# Altium schematic sheet Koruma.SchDoc (part 2 of 3)
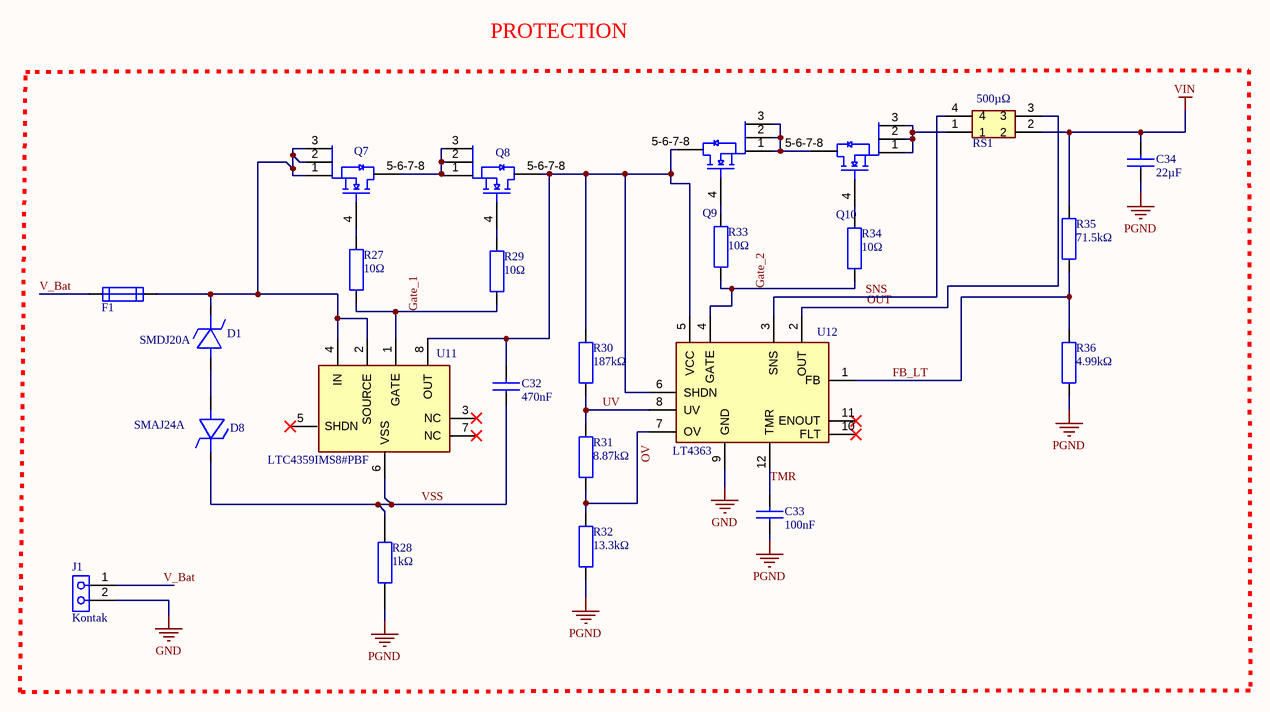
[diagram p1: Koruma.SchDoc]
## Library data of the parts
C32 = W3F15C4738AT1F: 0612/0805/1206 Feedthru Ceramic Capacitors 1206 50V 47000pF; Manufacturer: TAIYO YUDEN; Manufacturer Part Number: MCASU168SB7474KTCA01; Current Rating: 300mA; DC Resistance (DCR): 600mΩ; Insulation Resistance: 1GΩ; Number of Circuits: 1; Tolerance: 50%; Supplier: Arrow Electronics; Supplier Part Number: MCASU168SB7474KTCA01; RoHS: Compliant; Category: Ceramic Capacitors; Stock: 471; Pricing: 1=0,0439 (USD); Case/Package: 0603; Dielectric Material: Ceramic; Height: 800µm; Length: 1.6mm; Lifecycle Status: Production; Max Operating Temperature: 125°C; Min Operating Temperature: -55°C; Mounting Technology: Surface Mount; Number of Terminals: 2; Ratings: AEC-Q200; REACH SVHC: Yes; Voltage Rating (DC): 50V; Width: 800µm; ComponentLink1URL: https://datasheet.octopart.com:443/MCASU168SB7474KTCA01-Taiyo-Yuden-datasheet-182118782.pdf?src-supplier=IHS; ComponentLink1Description: https://datasheet.octopart.com:443/MCASU168SB7474KTCA01-Taiyo-Yuden-datasheet-182118782.pdf?src-supplier=IHS; ComponentLink2URL: https://datasheet.octopart.com:443/MCASU168SB7474KTCA01-Taiyo-Yuden-datasheet-176292839.pdf?src-supplier=Future+Electronics; ComponentLink2Description: https://datasheet.octopart.com:443/MCASU168SB7474KTCA01-Taiyo-Yuden-datasheet-176292839.pdf?src-supplier=Future+Electronics; ComponentLink3URL: https://datasheet.octopart.com:443/MCASU168SB7474KTCA01-Taiyo-Yuden-datasheet-182282442.pdf?src-supplier=Future+Electronics; ComponentLink3Description: https://datasheet.octopart.com:443/MCASU168SB7474KTCA01-Taiyo-Yuden-datasheet-182282442.pdf?src-supplier=Future+Electronics; China RoHS: Compliant; Export Control Classification Number (ECCN) Code: EAR99; Harmonized Tariff Schedule (HTS) Code: 8504.50.80.00; Introduction Date: 2002-04-23; Packaging: Tape and Reel; Termination: SMD/SMT; Voltage Rating: 50V; ComponentLink4URL: https://datasheet.octopart.com:443/W3F15C4738AT1F-KYOCERA-AVX-datasheet-159616755.pdf?src-supplier=IHS; ComponentLink4Description: https://datasheet.octopart.com:443/W3F15C4738AT1F-KYOCERA-AVX-datasheet-159616755.pdf?src-supplier=IHS; ComponentLink5URL: https://datasheet.octopart.com:443/W3F15C4738AT1F-AVX-datasheet-159777.pdf?src-supplier=Mouser; ComponentLink5Description: https://datasheet.octopart.com:443/W3F15C4738AT1F-AVX-datasheet-159777.pdf?src-supplier=Mouser; ComponentLink6URL: http://sigma.octopart.com:80/conflict_mineral_statement/AVX-company-34.pdf?src-supplier=Compliance+Statements; ComponentLink6Description: http://sigma.octopart.com:80/conflict_mineral_statement/AVX-company-34.pdf?src-supplier=Compliance+Statements; ComponentLink7URL: http://sigma.octopart.com:80/reach_statement/AVX-company-19.pdf?src-supplier=Compliance+Statements; ComponentLink7Description: http://sigma.octopart.com:80/reach_statement/AVX-company-19.pdf?src-supplier=Compliance+Statements
C33 = GRM155R71C104KA88D: 16V 100nF X7R ±10% 0402 Multilayer Ceramic Capacitors MLCC - SMD/SMT ROHS; Manufacturer: Murata; Manufacturer Lifecycle Status: NRND; Insulation Resistance: 10GΩ; Supplier: Future Electronics; Supplier Part Number: GRM155R71C104KA88D; Manufacturer Part Number: GRM155R71C104KA88D; RoHS: Compliant; Category: Ceramic Capacitors; Stock: 9240000; Pricing: 20000=0,001, 50000=0,001, 200000=0,0009, 500000=0,0009, 1250000=0,0009 (USD); Case/Package: 0402; Case Code (Imperial): 0402; Case Code (Metric): 1005; Country of Origin: Japan, Mainland China, Philippines, Singapore, Thailand; Depth: 500µm; Dielectric: X7R; Dielectric Material: Ceramic; Export Control Classification Number (ECCN) Code: EAR99; Height: 500µm; Harmonized Tariff Schedule (HTS) Code: 8532.24.00.20; Introduction Date: 2004-11-19; Lead Free: Lead Free; Length: 1mm; Lifecycle Status: NRND; Material: Ceramic; Max Operating Temperature: 125°C; Min Operating Temperature: -55°C; Mounting Technology: Surface Mount; Pins: 2; Number of Terminals: 2; Packaging: Cut Tape; Radiation Hardening: No; REACH SVHC: Yes; Schedule B: 8532240020, 8532240020|8532240020|8532240020|8532240020|8532240020|8532240020|8532240020|8532240020|8532240020|8532240020|8532240020|8532240020|8532240020, 8532240020|8532240020|8532240020|8532240020|8532240020|8532240020|8532240020|8532240020|8532240020|8532240020|8532240020|8532240020|8532240020|8532240020, 8532240020|8532240020|8532240020|8532240020|8532240020|8532240020|8532240020|8532240020|8532240020|8532240020|8532240020|8532240020|8532240020|8532240020|8532240020; Termination: SMD/SMT; Thickness: 500µm; Tolerance: 10%; Voltage: 16V; Voltage Rating: 16V; Voltage Rating (DC): 16V; Width: 500µm; ComponentLink1URL: https://datasheet.octopart.com:443/GRM155R71C104KA88D-Murata-datasheet-6387203.pdf?src-supplier=Upverter; ComponentLink1Description: https://datasheet.octopart.com:443/GRM155R71C104KA88D-Murata-datasheet-6387203.pdf?src-supplier=Upverter; ComponentLink2URL: https://datasheet.octopart.com:443/GRM155R71C104KA88D-Murata-datasheet-501912.pdf?src-supplier=Farnell; ComponentLink2Description: https://datasheet.octopart.com:443/GRM155R71C104KA88D-Murata-datasheet-501912.pdf?src-supplier=Farnell; ComponentLink3URL: https://datasheet.octopart.com:443/GRM155R71C104KA88D-Murata-datasheet-62320226.pdf?src-supplier=Farnell; ComponentLink3Description: https://datasheet.octopart.com:443/GRM155R71C104KA88D-Murata-datasheet-62320226.pdf?src-supplier=Farnell; ComponentLink4URL: https://datasheet.octopart.com:443/GRM155R71C104KA88D-Murata-datasheet-514334.pdf?src-supplier=Farnell; ComponentLink4Description: https://datasheet.octopart.com:443/GRM155R71C104KA88D-Murata-datasheet-514334.pdf?src-supplier=Farnell; ComponentLink5URL: https://datasheet.octopart.com:443/GRM155R71C104KA88D-Murata-datasheet-165579666.pdf?src-supplier=TME; ComponentLink5Description: https://datasheet.octopart.com:443/GRM155R71C104KA88D-Murata-datasheet-165579666.pdf?src-supplier=TME; ComponentLink6URL: https://datasheet.octopart.com:443/GRM155R71C104KA88D-Murata-datasheet-81455578.pdf?src-supplier=TME; ComponentLink6Description: https://datasheet.octopart.com:443/GRM155R71C104KA88D-Murata-datasheet-81455578.pdf?src-supplier=TME; ComponentLink7URL: https://datasheet.octopart.com:443/GRM155R71C104KA88D-Murata-datasheet-59876780.pdf?src-supplier=TME; ComponentLink7Description: https://datasheet.octopart.com:443/GRM155R71C104KA88D-Murata-datasheet-59876780.pdf?src-supplier=TME; ComponentLink8URL: https://datasheet.octopart.com:443/GRM155R71C104KA88D-Murata-datasheet-141266224.pdf?src-supplier=Ciiva; ComponentLink8Description: https://datasheet.octopart.com:443/GRM155R71C104KA88D-Murata-datasheet-141266224.pdf?src-supplier=Ciiva; ComponentLink9URL: https://datasheet.octopart.com:443/GRM155R71C104KA88D-Murata-datasheet-140690972.pdf?src-supplier=Ciiva; ComponentLink9Description: https://datasheet.octopart.com:443/GRM155R71C104KA88D-Murata-datasheet-140690972.pdf?src-supplier=Ciiva; ComponentLink10URL: https://datasheet.octopart.com:443/GRM155R71C104KA88D-Murata-datasheet-138740890.pdf?src-supplier=Ciiva; ComponentLink10Description: https://datasheet.octopart.com:443/GRM155R71C104KA88D-Murata-datasheet-138740890.pdf?src-supplier=Ciiva; ComponentLink11URL: https://datasheet.octopart.com:443/GRM155R71C104KA88D-Murata-datasheet-120101189.pdf?src-supplier=Megastar; ComponentLink11Description: https://datasheet.octopart.com:443/GRM155R71C104KA88D-Murata-datasheet-120101189.pdf?src-supplier=Megastar; ComponentLink12URL: https://datasheet.octopart.com:443/GRM155R71C104KA88D-Murata-datasheet-96971104.pdf?src-supplier=Future+Electronics; ComponentLink12Description: https://datasheet.octopart.com:443/GRM155R71C104KA88D-Murata-datasheet-96971104.pdf?src-supplier=Future+Electronics; ComponentLink13URL: https://datasheet.octopart.com:443/GRM155R71C104KA88D-Murata-datasheet-22122223.pdf?src-supplier=Future+Electronics; ComponentLink13Description: https://datasheet.octopart.com:443/GRM155R71C104KA88D-Murata-datasheet-22122223.pdf?src-supplier=Future+Electronics; ComponentLink14URL: https://datasheet.octopart.com:443/GRM155R71C104KA88D-Murata-datasheet-14400564.pdf?src-supplier=Future+Electronics; ComponentLink14Description: https://datasheet.octopart.com:443/GRM155R71C104KA88D-Murata-datasheet-14400564.pdf?src-supplier=Future+Electronics; ComponentLink15URL: https://datasheet.octopart.com:443/GRM155R71C104KA88D-Murata-datasheet-44106293.pdf?src-supplier=Future+Electronics; ComponentLink15Description: https://datasheet.octopart.com:443/GRM155R71C104KA88D-Murata-datasheet-44106293.pdf?src-supplier=Future+Electronics; ComponentLink16URL: https://datasheet.octopart.com/GRM155R71C104KA88D-Murata-datasheet-12515295.pdf; ComponentLink16Description: https://datasheet.octopart.com/GRM155R71C104KA88D-Murata-datasheet-12515295.pdf; ComponentLink17URL: https://datasheet.octopart.com/GRM155R71C104KA88D-Murata-datasheet-12510076.pdf; ComponentLink17Description: https://datasheet.octopart.com/GRM155R71C104KA88D-Murata-datasheet-12510076.pdf; ComponentLink18URL: https://datasheet.octopart.com/GRM155R71C104KA88D-Murata-datasheet-11978611.pdf; ComponentLink18Description: https://datasheet.octopart.com/GRM155R71C104KA88D-Murata-datasheet-11978611.pdf; ComponentLink19URL: https://datasheet.octopart.com/GRM155R71C104KA88D-Murata-datasheet-10025737.pdf; ComponentLink19Description: https://datasheet.octopart.com/GRM155R71C104KA88D-Murata-datasheet-10025737.pdf; ComponentLink20URL: https://datasheet.octopart.com/GRM155R71C104KA88D-Murata-datasheet-8819587.pdf; ComponentLink20Description: https://datasheet.octopart.com/GRM155R71C104KA88D-Murata-datasheet-8819587.pdf; ComponentLink21URL: https://datasheet.octopart.com/GRM155R71C104KA88D-Murata-datasheet-12555248.pdf; ComponentLink21Description: https://datasheet.octopart.com/GRM155R71C104KA88D-Murata-datasheet-12555248.pdf; ComponentLink22URL: https://datasheet.octopart.com:443/GRM155R71C104KA88D-Murata-datasheet-11864723.pdf?src-supplier=Arrow+Electronics; ComponentLink22Description: https://datasheet.octopart.com:443/GRM155R71C104KA88D-Murata-datasheet-11864723.pdf?src-supplier=Arrow+Electronics; ComponentLink23URL: https://datasheet.octopart.com:443/GRM155R71C104KA88D-Murata-datasheet-148211.pdf?src-supplier=Garrett; ComponentLink23Description: https://datasheet.octopart.com:443/GRM155R71C104KA88D-Murata-datasheet-148211.pdf?src-supplier=Garrett; ComponentLink24URL: https://datasheet.octopart.com:443/GRM155R71C104KA88D-Murata-datasheet-118811.pdf?src-supplier=DigiKey; ComponentLink24Description: https://datasheet.octopart.com:443/GRM155R71C104KA88D-Murata-datasheet-118811.pdf?src-supplier=DigiKey; ComponentLink25URL: https://datasheet.octopart.com:443/GRM155R71C104KA88D-Murata-datasheet-38265814.pdf?src-supplier=Newark; ComponentLink25Description: https://datasheet.octopart.com:443/GRM155R71C104KA88D-Murata-datasheet-38265814.pdf?src-supplier=Newark; ComponentLink26URL: http://sigma.octopart.com:80/reach_statement/Murata-company-16.pdf?src-supplier=Compliance+Statements; ComponentLink26Description: http://sigma.octopart.com:80/reach_statement/Murata-company-16.pdf?src-supplier=Compliance+Statements
C34 = C5750X7R1H226M250KB: 50V 22uF X7R 卤20% 2220 Multilayer Ceramic Capacitors MLCC - SMD/SMT ROHS; Manufacturer: TDK; Manufacturer Lifecycle Status: PRODUCTION; Tolerance: 20%; Supplier: Farnell; Supplier Part Number: C5750X7R1H226M250KB; Manufacturer Part Number: C5750X7R1H226M250KB; RoHS: Compliant; Category: Ceramic Capacitors; Stock: 4; Pricing: 1=3,8, 10=2,29, 50=2,23, 100=2,16, 200=2,06, 500=1,96 (EUR); Case/Package: 2220; Case Code (Metric): 5750; China RoHS: Compliant; Dielectric: X7R; Dielectric Material: Ceramic; Export Control Classification Number (ECCN) Code: EAR99; Height: 2.5mm; Harmonized Tariff Schedule (HTS) Code: 8532.24.00.20; Introduction Date: 2019-03-19; Lead Free: Lead Free; Length: 5.7mm; Lifecycle Status: Production; Material: Ceramic; Max Length: 6.1mm; Max Operating Temperature: 125°C; Max Width: 5.4mm; Min Length: 5.3mm; Min Operating Temperature: -55°C; Min Width: 4.6mm; Mounting Technology: Surface Mount; Number of Terminals: 2; REACH SVHC: Yes; Thickness: 2.5mm; Voltage Rating: 50V; Voltage Rating (DC): 50V; Width: 5mm; ComponentLink1URL: https://datasheet.octopart.com:443/C5750X7R1H226M250KB-TDK-datasheet-175423548.pdf?src-supplier=TME; ComponentLink1Description: https://datasheet.octopart.com:443/C5750X7R1H226M250KB-TDK-datasheet-175423548.pdf?src-supplier=TME; ComponentLink2URL: https://datasheet.octopart.com:443/C5750X7R1H226M250KB-TDK-datasheet-68298673.pdf?src-supplier=Upverter; ComponentLink2Description: https://datasheet.octopart.com:443/C5750X7R1H226M250KB-TDK-datasheet-68298673.pdf?src-supplier=Upverter; ComponentLink3URL: https://datasheet.octopart.com:443/C5750X7R1H226M250KB-TDK-datasheet-151546523.pdf?src-supplier=ODG+(Origin+Data+Global); ComponentLink3Description: https://datasheet.octopart.com:443/C5750X7R1H226M250KB-TDK-datasheet-151546523.pdf?src-supplier=ODG+(Origin+Data+Global); ComponentLink4URL: https://datasheet.octopart.com:443/C5750X7R1H226M250KB-TDK-datasheet-154546117.pdf?src-supplier=Farnell; ComponentLink4Description: https://datasheet.octopart.com:443/C5750X7R1H226M250KB-TDK-datasheet-154546117.pdf?src-supplier=Farnell; ComponentLink5URL: https://datasheet.octopart.com/C5750X7R1H226M250KB-TDK-datasheet-41194876.pdf; ComponentLink5Description: https://datasheet.octopart.com/C5750X7R1H226M250KB-TDK-datasheet-41194876.pdf; ComponentLink6URL: https://datasheet.octopart.com/C-Series-Ceramic-Chip-Capacitors-TDK-datasheet-family-84.pdf; ComponentLink6Description: https://datasheet.octopart.com/C-Series-Ceramic-Chip-Capacitors-TDK-datasheet-family-84.pdf; ComponentLink7URL: http://sigma.octopart.com:80/rohs_certificate/C-Series-Ceramic-Chip-Capacitors-TDK-family-108.pdf?src-supplier=Compliance+Statements; ComponentLink7Description: http://sigma.octopart.com:80/rohs_certificate/C-Series-Ceramic-Chip-Capacitors-TDK-family-108.pdf?src-supplier=Compliance+Statements
D1 = SMDJ20A: SMDJ Series 20 V 3000 W Surface Mount Uni-Directional TVS Diode - DO-214AB; Manufacturer: Littelfuse; Breakdown Voltage: 23.35V; Clamping Voltage: 32.4V; Direction: Unidirectional; Leakage Current: 2µA; Max Breakdown Voltage: 24.5V; Max Power Dissipation: 6.5W; Max Surge Current: 92.6A; Min Breakdown Voltage: 22.2V; Number of Channels: 1; Operating Supply Voltage: 20V; Peak Pulse Power: 3kW; Power Line Protection: No; Test Current: 1mA; Supplier: Farnell; Supplier Part Number: SMDJ20A; Manufacturer Part Number: SMDJ20A; RoHS: Compliant; Category: TVS Diodes; Stock: 2450; Pricing: 1=0,585, 10=0,485, 100=0,368, 500=0,347, 1000=0,34 (EUR); China RoHS: Non-Compliant; Composition: Zener; Lead Free: Lead Free; Lifecycle Status: Production; Max Operating Temperature: 150°C; Max Reverse Leakage Current: 2µA; Min Operating Temperature: -65°C; Mounting Technology: Surface Mount; Number of Elements: 1; Pins: 2; Number of Terminals: 2; Number of Unidirectional Channels: 1; Packaging: Cut Tape; Peak Pulse Current: 92.6A; Polarity: Unidirectional; Power Dissipation: 3kW; REACH SVHC: No; Reverse Breakdown Voltage: 22.2V; Reverse Standoff Voltage: 20V; Reverse Voltage: 20V; Schedule B: 8541100080, 8541100080|8541100080|8541100080|8541100080|8541100080; Termination: SMD/SMT; ComponentLink1URL: https://datasheet.octopart.com:443/SMDJ20A-Littelfuse-datasheet-150463583.pdf?src-supplier=Farnell; ComponentLink1Description: https://datasheet.octopart.com:443/SMDJ20A-Littelfuse-datasheet-150463583.pdf?src-supplier=Farnell; ComponentLink2URL: https://datasheet.octopart.com:443/SMDJ20A-Littelfuse-datasheet-63711006.pdf?src-supplier=element14+APAC; ComponentLink2Description: https://datasheet.octopart.com:443/SMDJ20A-Littelfuse-datasheet-63711006.pdf?src-supplier=element14+APAC; ComponentLink3URL: https://datasheet.octopart.com:443/SMDJ20A-Littelfuse-datasheet-23805045.pdf?src-supplier=Future+Electronics; ComponentLink3Description: https://datasheet.octopart.com:443/SMDJ20A-Littelfuse-datasheet-23805045.pdf?src-supplier=Future+Electronics; ComponentLink4URL: https://datasheet.octopart.com:443/SMDJ20A-Littelfuse-datasheet-14434287.pdf?src-supplier=Future+Electronics; ComponentLink4Description: https://datasheet.octopart.com:443/SMDJ20A-Littelfuse-datasheet-14434287.pdf?src-supplier=Future+Electronics; ComponentLink5URL: https://datasheet.octopart.com:443/SMDJ20A-Littelfuse-datasheet-130255154.pdf?src-supplier=Littelfuse+SCT; ComponentLink5Description: https://datasheet.octopart.com:443/SMDJ20A-Littelfuse-datasheet-130255154.pdf?src-supplier=Littelfuse+SCT; ComponentLink6URL: https://datasheet.octopart.com:443/SMDJ20A-Littelfuse-datasheet-10978972.pdf?src-supplier=TME; ComponentLink6Description: https://datasheet.octopart.com:443/SMDJ20A-Littelfuse-datasheet-10978972.pdf?src-supplier=TME; ComponentLink7URL: https://datasheet.octopart.com:443/SMDJ20A-Littelfuse-datasheet-32025630.pdf?src-supplier=Fuses+Unlimited; ComponentLink7Description: https://datasheet.octopart.com:443/SMDJ20A-Littelfuse-datasheet-32025630.pdf?src-supplier=Fuses+Unlimited
D8 = SMAJ24A: SMAJ Series 400 W 24 V Uni-Directional Surface Mount TVS Diode - DO-214AC; Manufacturer: Littelfuse; Breakdown Voltage: 28.1V; Value: 650pF; Clamping Voltage: 38.9V; Direction: Unidirectional; Element Configuration: Single; Forward Voltage: 3.5V; Leakage Current: 1µA; Max Breakdown Voltage: 29.5V; Max Junction Temperature (Tj): 150°C; Max Output current: 10.3A; Max Power Dissipation: 3.3W; Min Breakdown Voltage: 26.7V; Number of Channels: 1; Operating Supply Voltage: 24V; Peak Pulse Power: 400W; Power Line Protection: No; Test Current: 1mA; Supplier: Farnell; Supplier Part Number: SMAJ24A; Manufacturer Part Number: SMAJ24A; RoHS: Compliant; Category: TVS Diodes; Stock: 10000; Pricing: 5000=0,121, 15000=0,106 (EUR); Case/Package: SMA; China RoHS: Non-Compliant; Composition: Zener; Export Control Classification Number (ECCN) Code: EAR99; Height: 2.29mm; Harmonized Tariff Schedule (HTS) Code: 8541.10.00.50; Introduction Date: 2003-11-20; Lead Free: Lead Free; Length: 4.5mm; Lifecycle Status: Production; Max Operating Temperature: 150°C; Max Reverse Leakage Current: 1µA; Max Surge Current: 10.3A; Min Operating Temperature: -65°C; Mounting Technology: Surface Mount; Number of Elements: 1; Pins: 2; Number of Terminals: 2; Number of Unidirectional Channels: 1; Packaging: Tape & Reel; Peak Pulse Current: 10.3A; Peak Reverse Current: 1µA; Polarity: Unidirectional; Power Dissipation: 400W; Power Rating: 400W; Radiation Hardening: No; REACH SVHC: No; Reverse Breakdown Voltage: 26.7V; Reverse Standoff Voltage: 24V; Reverse Voltage: 24V; Schedule B: 8541100080, 8541100080|8541100080|8541100080|8541100080|8541100080; Termination: SMD/SMT; Voltage Rating (DC): 24V; Width: 2.79mm; ComponentLink1URL: https://datasheet.octopart.com:443/SMAJ24A-Littelfuse-datasheet-150463581.pdf?src-supplier=Farnell; ComponentLink1Description: https://datasheet.octopart.com:443/SMAJ24A-Littelfuse-datasheet-150463581.pdf?src-supplier=Farnell; ComponentLink2URL: https://datasheet.octopart.com:443/SMAJ24A-Littelfuse-datasheet-63710798.pdf?src-supplier=element14+APAC; ComponentLink2Description: https://datasheet.octopart.com:443/SMAJ24A-Littelfuse-datasheet-63710798.pdf?src-supplier=element14+APAC; ComponentLink3URL: https://datasheet.octopart.com:443/SMAJ24A-Littelfuse-datasheet-11547152.pdf?src-supplier=element14+APAC; ComponentLink3Description: https://datasheet.octopart.com:443/SMAJ24A-Littelfuse-datasheet-11547152.pdf?src-supplier=element14+APAC; ComponentLink4URL: https://datasheet.octopart.com:443/SMAJ24A-Littelfuse-datasheet-5393952.pdf?src-supplier=element14+APAC; ComponentLink4Description: https://datasheet.octopart.com:443/SMAJ24A-Littelfuse-datasheet-5393952.pdf?src-supplier=element14+APAC; ComponentLink5URL: https://datasheet.octopart.com:443/SMAJ24A-Littelfuse-datasheet-511791.pdf?src-supplier=element14+APAC; ComponentLink5Description: https://datasheet.octopart.com:443/SMAJ24A-Littelfuse-datasheet-511791.pdf?src-supplier=element14+APAC; ComponentLink6URL: https://datasheet.octopart.com:443/SMAJ24A-Littelfuse-datasheet-164649624.pdf?src-supplier=JRH+Electronics; ComponentLink6Description: https://datasheet.octopart.com:443/SMAJ24A-Littelfuse-datasheet-164649624.pdf?src-supplier=JRH+Electronics; ComponentLink7URL: https://datasheet.octopart.com:443/SMAJ24A-Littelfuse-datasheet-38878911.pdf?src-supplier=RS+(Formerly+Allied+Electronics); ComponentLink7Description: https://datasheet.octopart.com:443/SMAJ24A-Littelfuse-datasheet-38878911.pdf?src-supplier=RS+(Formerly+Allied+Electronics); ComponentLink8URL: https://datasheet.octopart.com:443/SMAJ24A-Littelfuse-datasheet-17901671.pdf?src-supplier=Future+Electronics; ComponentLink8Description: https://datasheet.octopart.com:443/SMAJ24A-Littelfuse-datasheet-17901671.pdf?src-supplier=Future+Electronics; ComponentLink9URL: https://datasheet.octopart.com:443/SMAJ24A-Littelfuse-datasheet-1053.pdf?src-supplier=DigiKey; ComponentLink9Description: https://datasheet.octopart.com:443/SMAJ24A-Littelfuse-datasheet-1053.pdf?src-supplier=DigiKey
F1 = SF-3812F6000T-2: SMD Fuse, Fast Acting, 60 A, 250 VAC, 100 VDC, 3812 [10030 Metric], SF-3812F-T; Manufacturer: Bourns; Current Rating: 60A; Value: 900µΩ; Voltage Rating: 250V; Voltage Rating (DC): 100V; Supplier: Farnell; Supplier Part Number: SF-3812F6000T-2; Manufacturer Part Number: SF-3812F6000T-2; RoHS: Compliant; Category: Fuses; Pricing: 5000=2,08 (EUR); Country of Origin: Taiwan; Export Control Classification Number (ECCN) Code: EAR99; Fuse Current: 60A; Height: 3.1mm; Harmonized Tariff Schedule (HTS) Code: 8536.10.00.40; Introduction Date: 2021-05-18; Length: 10.1mm; Lifecycle Status: Production; Max Operating Temperature: 125°C; Min Operating Temperature: -55°C; Mounting Technology: Surface Mount; REACH SVHC: No; Voltage Rating (AC): 250V; ComponentLink1URL: https://datasheet.octopart.com:443/SF-3812F6000T-2-Bourns-datasheet-169981795.pdf?src-supplier=Upverter; ComponentLink1Description: https://datasheet.octopart.com:443/SF-3812F6000T-2-Bourns-datasheet-169981795.pdf?src-supplier=Upverter; ComponentLink2URL: http://sigma.octopart.com:80/conflict_mineral_statement/Bourns-company-36.pdf?src-supplier=Compliance+Statements; ComponentLink2Description: http://sigma.octopart.com:80/conflict_mineral_statement/Bourns-company-36.pdf?src-supplier=Compliance+Statements
J1 = Terminal Block - 2pin
Q7-Q10 = BSC010N04LSI: Transistor: N-MOSFET; unipolar; 40V; 100A; 139W; PG-TDSON-8; Manufacturer: Infineon; Manufacturer Part Number: BSC010N04LSIATMA1; Continuous Drain Current (ID): 37A; Drain to Source Resistance: 1.4mΩ; Fall Time: 17ns; Gate to Source Voltage (Vgs): 20V; Input Capacitance: 6.2nF; Max Junction Temperature (Tj): 150°C; Number of Channels: 1; On-State Resistance: 1.05mΩ; Power Dissipation: 2.5W; Rise Time: 48ns; Turn-Off Delay Time: 33ns; Turn-On Delay Time: 9ns; Supplier: Farnell; Supplier Part Number: BSC010N04LSIATMA1; RoHS: Compliant; Category: MOSFETs; Stock: 10731; Pricing: 5=3,14, 50=2,04, 250=1,46, 1000=1,02, 3000=1 (EUR); China RoHS: Non-Compliant; Country of Origin: Germany, Mainland China; Drain to Source Breakdown Voltage: 40V; Drain to Source Voltage (Vdss): 40V; Export Control Classification Number (ECCN) Code: EAR99; Halogen Free: Halogen Free; Height: 1.1mm; Introduction Date: 2012-02-06; Lead Free: Contains Lead; Lifecycle Status: Production; Max Dual Supply Voltage: 40V; Max Operating Temperature: 150°C; Max Power Dissipation: 139W; Min Breakdown Voltage: 40V; Min Operating Temperature: -55°C; Mounting Technology: Surface Mount; Number of Elements: 1; Pins: 8; Number of Terminals: 8; Package Quantity: 5000; Packaging: Tape & Reel; Rds On Max: 1.05mΩ; REACH SVHC: No; Schedule B: 8541290080, 8541290080|8541290080|8541290080|8541290080|8541290080|8541290080|8541290080|8541290080|8541290080|8541290080|8541290080|8541290080|8541290080|8541290080|8541290080|8541290080|8541290080|8541290080|8541290080|8541290080|8541290080|8541290080|8541290080|85; ComponentLink1URL: https://datasheet.octopart.com:443/BSC010N04LSIATMA1-Infineon-datasheet-82520598.pdf?src-supplier=ODG+(Origin+Data+Global); ComponentLink1Description: https://datasheet.octopart.com:443/BSC010N04LSIATMA1-Infineon-datasheet-82520598.pdf?src-supplier=ODG+(Origin+Data+Global); ComponentLink2URL: https://datasheet.octopart.com:443/BSC010N04LSIATMA1-Infineon-datasheet-62293607.pdf?src-supplier=TME; ComponentLink2Description: https://datasheet.octopart.com:443/BSC010N04LSIATMA1-Infineon-datasheet-62293607.pdf?src-supplier=TME; ComponentLink3URL: http://sigma.octopart.com:80/conflict_mineral_statement/Infineon-company-51.pdf?src-supplier=Compliance+Statements; ComponentLink3Description: http://sigma.octopart.com:80/conflict_mineral_statement/Infineon-company-51.pdf?src-supplier=Compliance+Statements
R27 R29 R33 R34 = SR0805FR-7W10RL: Res Thick Film 0805 10 Ohm 1% 0.25W(1/4W) ±200ppm/C Pad SMD Automotive T/R; Manufacturer: Yageo Group; Power Rating: 250mW; Temperature Coefficient: 100ppm/°C; Voltage Rating: 150V; Working Voltage: 500V; Supplier: Arrow Electronics; Supplier Part Number: SR0805FR-7W10RL; Manufacturer Part Number: SR0805FR-7W10RL; RoHS: Compliant; Category: Chip SMD Resistors; Stock: 30000; Pricing: 5000=0,0587, 10000=0,0564 (USD); Case/Package: 0805; China RoHS: Non-Compliant; Composition: Thick Film; Country of Origin: Mainland China, Taiwan; Export Control Classification Number (ECCN) Code: EAR99; Height: 500µm; Harmonized Tariff Schedule (HTS) Code: 8533.21.00.30; Introduction Date: 2017-06-07; Length: 2mm; Lifecycle Status: Production; Max Operating Temperature: 155°C; Min Operating Temperature: -55°C; Mounting Technology: Surface Mount; Number of Terminals: 2; Packaging: Tape & Reel; Ratings: AEC-Q200; REACH SVHC: Yes; Tolerance: 1%; Width: 1.25mm; ComponentLink1URL: https://datasheet.octopart.com:443/SR0805FR-7W10RL-Yageo-datasheet-176402240.pdf?src-supplier=JRH+Electronics; ComponentLink1Description: https://datasheet.octopart.com:443/SR0805FR-7W10RL-Yageo-datasheet-176402240.pdf?src-supplier=JRH+Electronics; ComponentLink2URL: https://datasheet.octopart.com:443/SR0805FR-7W10RL-Yageo-datasheet-119732217.pdf?src-supplier=Upverter; ComponentLink2Description: https://datasheet.octopart.com:443/SR0805FR-7W10RL-Yageo-datasheet-119732217.pdf?src-supplier=Upverter; ComponentLink3URL: https://datasheet.octopart.com:443/SR0805FR-7W10RL-Yageo-datasheet-155675517.pdf?src-supplier=ODG+(Origin+Data+Global); ComponentLink3Description: https://datasheet.octopart.com:443/SR0805FR-7W10RL-Yageo-datasheet-155675517.pdf?src-supplier=ODG+(Origin+Data+Global); ComponentLink4URL: https://datasheet.octopart.com:443/SR0805FR-7W10RL-Yageo-Group-datasheet-184785656.pdf?src-supplier=Future+Electronics; ComponentLink4Description: https://datasheet.octopart.com:443/SR0805FR-7W10RL-Yageo-Group-datasheet-184785656.pdf?src-supplier=Future+Electronics; ComponentLink5URL: https://datasheet.octopart.com:443/SR0805FR-7W10RL-Yageo-datasheet-137701088.pdf?src-supplier=Future+Electronics; ComponentLink5Description: https://datasheet.octopart.com:443/SR0805FR-7W10RL-Yageo-datasheet-137701088.pdf?src-supplier=Future+Electronics; ComponentLink6URL: https://datasheet.octopart.com:443/SR0805FR-7W10RL-Yageo-Group-datasheet-188692432.pdf?src-supplier=Farnell; ComponentLink6Description: https://datasheet.octopart.com:443/SR0805FR-7W10RL-Yageo-Group-datasheet-188692432.pdf?src-supplier=Farnell; ComponentLink7URL: https://datasheet.octopart.com/SR0805FR-7W10RL-Yageo-datasheet-11047080.pdf; ComponentLink7Description: https://datasheet.octopart.com/SR0805FR-7W10RL-Yageo-datasheet-11047080.pdf; ComponentLink8URL: http://sigma.octopart.com:80/conflict_mineral_statement/Yageo-company-3.pdf?src-supplier=Compliance+Statements; ComponentLink8Description: http://sigma.octopart.com:80/conflict_mineral_statement/Yageo-company-3.pdf?src-supplier=Compliance+Statements; ComponentLink9URL: http://sigma.octopart.com:80/rohs_statement/Yageo-company-2.pdf?src-supplier=Compliance+Statements; ComponentLink9Description: http://sigma.octopart.com:80/rohs_statement/Yageo-company-2.pdf?src-supplier=Compliance+Statements
R28 = SR1206FR-071KL: Fixed Resistor, Metal Glaze/thick Film, 0.25W, 1000ohm, 500V, 1% +/-Tol, 100ppm/Cel, Surface Mount, 1206; Manufacturer: Yageo Group; Max Power Dissipation: 250mW; Temperature Coefficient: 100ppm/°C; Working Voltage: 200V; Supplier: Avnet; Supplier Part Number: SR1206FR-071KL; Manufacturer Part Number: SR1206FR-071KL; RoHS: Compliant; Category: Chip SMD Resistors; Pricing: 5000=0,02852, 10000=0,02837, 20000=0,02823, 30000=0,02808, 40000=0,02794 (USD); Case/Package: 1206; China RoHS: Non-Compliant; Composition: Thick Film; Country of Origin: Mainland China, Taiwan; Export Control Classification Number (ECCN) Code: EAR99; Features: Automotive AEC-Q200; Height: 550µm; Harmonized Tariff Schedule (HTS) Code: 8533.21.00.30; Introduction Date: 2015-12-01; Length: 3.1mm; Lifecycle Status: Production; Max Operating Temperature: 155°C; Min Operating Temperature: -55°C; Mounting Technology: Surface Mount; Number of Terminals: 2; Number of Terminations: 2; Packaging: Tape & Reel; Power Rating: 250mW; Ratings: AEC-Q200; REACH SVHC: Yes; Tolerance: 1%; Width: 1.6mm; ComponentLink1URL: https://datasheet.octopart.com:443/SR1206FR-071KL-Yageo-datasheet-176402240.pdf?src-supplier=IHS; ComponentLink1Description: https://datasheet.octopart.com:443/SR1206FR-071KL-Yageo-datasheet-176402240.pdf?src-supplier=IHS; ComponentLink2URL: https://datasheet.octopart.com/SR1206FR-071KL-Yageo-datasheet-11047080.pdf; ComponentLink2Description: https://datasheet.octopart.com/SR1206FR-071KL-Yageo-datasheet-11047080.pdf; ComponentLink3URL: http://sigma.octopart.com:80/conflict_mineral_statement/Yageo-company-3.pdf?src-supplier=Compliance+Statements; ComponentLink3Description: http://sigma.octopart.com:80/conflict_mineral_statement/Yageo-company-3.pdf?src-supplier=Compliance+Statements; ComponentLink4URL: http://sigma.octopart.com:80/rohs_statement/Yageo-company-2.pdf?src-supplier=Compliance+Statements; ComponentLink4Description: http://sigma.octopart.com:80/rohs_statement/Yageo-company-2.pdf?src-supplier=Compliance+Statements
R30 = RC0805FR-07187KL: Res Thick Film 0805 187K Ohm 1% 0.125W(1/8W) ±100ppm/C Pad SMD T/R; Manufacturer: Yageo Group; Manufacturer Package Identifier: 0805 (2012 metric); Max Power Dissipation: 125mW; Temperature Coefficient: 100ppm/°C; Voltage Rating: 150V; Supplier: Farnell; Supplier Part Number: RC0805FR-07187KL.; Manufacturer Part Number: RC0805FR-07187KL; RoHS: Compliant; Category: Chip SMD Resistors; Stock: 1946; Pricing: 1=0,0999, 25=0,0088, 100=0,0077 (EUR); Case/Package: 0805; Case Code (Imperial): 0805; China RoHS: Non-Compliant; Composition: Thick Film; Contact Plating: Lead, Tin; Country of Origin: Mainland China, Taiwan; Export Control Classification Number (ECCN) Code: EAR99; Features: Moisture Resistant; Height: 500µm; Harmonized Tariff Schedule (HTS) Code: 8533.21.00.30; Introduction Date: 2004-09-22; Lead Free: Lead Free; Length: 2mm; Lifecycle Status: Production; Max Operating Temperature: 155°C; Min Operating Temperature: -55°C; Mounting Technology: Surface Mount; Number of Terminals: 2; Number of Terminations: 2; Power Rating: 125mW; Radiation Hardening: No; REACH SVHC: Yes; Schedule B: 8533210045, 8533210045|8533210045|8533210045|8533210045|8533210045; Termination: SMD/SMT; Tolerance: 1%; Width: 1.25mm; Working Voltage: 150V; ComponentLink1URL: https://datasheet.octopart.com:443/RC0805FR-07187KL-Yageo-datasheet-175887523.pdf?src-supplier=IHS; ComponentLink1Description: https://datasheet.octopart.com:443/RC0805FR-07187KL-Yageo-datasheet-175887523.pdf?src-supplier=IHS; ComponentLink2URL: https://datasheet.octopart.com:443/RC0805FR-07187KL-Yageo-datasheet-103092701.pdf?src-supplier=Upverter; ComponentLink2Description: https://datasheet.octopart.com:443/RC0805FR-07187KL-Yageo-datasheet-103092701.pdf?src-supplier=Upverter; ComponentLink3URL: https://datasheet.octopart.com:443/RC0805FR-07187KL-Yageo-Group-datasheet-190305687.pdf?src-supplier=Future+Electronics; ComponentLink3Description: https://datasheet.octopart.com:443/RC0805FR-07187KL-Yageo-Group-datasheet-190305687.pdf?src-supplier=Future+Electronics; ComponentLink4URL: https://datasheet.octopart.com:443/RC0805FR-07187KL-Yageo-datasheet-12592811.pdf?src-supplier=Future+Electronics; ComponentLink4Description: https://datasheet.octopart.com:443/RC0805FR-07187KL-Yageo-datasheet-12592811.pdf?src-supplier=Future+Electronics; ComponentLink5URL: https://datasheet.octopart.com:443/RC0805FR-07187KL-Yageo-datasheet-8330313.pdf?src-supplier=Future+Electronics; ComponentLink5Description: https://datasheet.octopart.com:443/RC0805FR-07187KL-Yageo-datasheet-8330313.pdf?src-supplier=Future+Electronics; ComponentLink6URL: https://datasheet.octopart.com:443/RC0805FR-07187KL-Yageo-datasheet-8324252.pdf?src-supplier=Future+Electronics; ComponentLink6Description: https://datasheet.octopart.com:443/RC0805FR-07187KL-Yageo-datasheet-8324252.pdf?src-supplier=Future+Electronics; ComponentLink7URL: https://datasheet.octopart.com/RC0805FR-07187KL-Yageo-datasheet-73766026.pdf; ComponentLink7Description: https://datasheet.octopart.com/RC0805FR-07187KL-Yageo-datasheet-73766026.pdf; ComponentLink8URL: https://datasheet.octopart.com:443/RC0805FR-07187KL-Yageo-datasheet-118657.pdf?src-supplier=DigiKey; ComponentLink8Description: https://datasheet.octopart.com:443/RC0805FR-07187KL-Yageo-datasheet-118657.pdf?src-supplier=DigiKey; ComponentLink9URL: http://sigma.octopart.com:80/conflict_mineral_statement/Yageo-company-3.pdf?src-supplier=Compliance+Statements; ComponentLink9Description: http://sigma.octopart.com:80/conflict_mineral_statement/Yageo-company-3.pdf?src-supplier=Compliance+Statements; ComponentLink10URL: http://sigma.octopart.com:80/rohs_statement/Yageo-company-2.pdf?src-supplier=Compliance+Statements; ComponentLink10Description: http://sigma.octopart.com:80/rohs_statement/Yageo-company-2.pdf?src-supplier=Compliance+Statements
R31 = RC0805FR-078K87L: Res Thick Film 0805 8.87K Ohm 1% 0.125W(1/8W) ±100ppm/C Pad SMD T/R; Manufacturer: Yageo Group; Manufacturer Package Identifier: 0805 (2012 metric); Max Power Dissipation: 125mW; Temperature Coefficient: 100ppm/°C; Voltage Rating: 150V; Supplier: Farnell; Supplier Part Number: RC0805FR-078K87L; Manufacturer Part Number: RC0805FR-078K87L; RoHS: Compliant; Category: Chip SMD Resistors; Stock: 10000; Pricing: 5000=0,004 (EUR); Case/Package: 0805; Case Code (Imperial): 0805; China RoHS: Non-Compliant; Composition: Thick Film; Contact Plating: Lead, Tin; Depth: 1.25mm; Features: Moisture Resistant; Height: 500µm; Lead Free: Lead Free; Length: 2mm; Lifecycle Status: Production; Max Operating Temperature: 155°C; Military Standard: Not; Min Operating Temperature: -55°C; Mounting Technology: Surface Mount; Number of Terminals: 2; Number of Terminations: 2; Power Rating: 125mW; Radiation Hardening: No; REACH SVHC: Yes; Schedule B: 8533210045, 8533210045|8533210045|8533210045|8533210045|8533210045; Termination: SMD/SMT; Tolerance: 1%; Voltage Rating (DC): 150V; Width: 1.25mm; Working Voltage: 150V; ComponentLink1URL: https://datasheet.octopart.com:443/RC0805FR-078K87L-Yageo-datasheet-175887523.pdf?src-supplier=Newark; ComponentLink1Description: https://datasheet.octopart.com:443/RC0805FR-078K87L-Yageo-datasheet-175887523.pdf?src-supplier=Newark; ComponentLink2URL: https://datasheet.octopart.com:443/RC0805FR-078K87L-Yageo-datasheet-103092701.pdf?src-supplier=Upverter; ComponentLink2Description: https://datasheet.octopart.com:443/RC0805FR-078K87L-Yageo-datasheet-103092701.pdf?src-supplier=Upverter; ComponentLink3URL: https://datasheet.octopart.com:443/RC0805FR-078K87L-Yageo-Group-datasheet-176638170.pdf?src-supplier=Future+Electronics; ComponentLink3Description: https://datasheet.octopart.com:443/RC0805FR-078K87L-Yageo-Group-datasheet-176638170.pdf?src-supplier=Future+Electronics; ComponentLink4URL: https://datasheet.octopart.com:443/RC0805FR-078K87L-Yageo-datasheet-164759695.pdf?src-supplier=Future+Electronics; ComponentLink4Description: https://datasheet.octopart.com:443/RC0805FR-078K87L-Yageo-datasheet-164759695.pdf?src-supplier=Future+Electronics; ComponentLink5URL: https://datasheet.octopart.com:443/RC0805FR-078K87L-Yageo-datasheet-12592811.pdf?src-supplier=Future+Electronics; ComponentLink5Description: https://datasheet.octopart.com:443/RC0805FR-078K87L-Yageo-datasheet-12592811.pdf?src-supplier=Future+Electronics; ComponentLink6URL: https://datasheet.octopart.com:443/RC0805FR-078K87L-Yageo-datasheet-8330313.pdf?src-supplier=Future+Electronics; ComponentLink6Description: https://datasheet.octopart.com:443/RC0805FR-078K87L-Yageo-datasheet-8330313.pdf?src-supplier=Future+Electronics; ComponentLink7URL: https://datasheet.octopart.com:443/RC0805FR-078K87L-Yageo-datasheet-8324252.pdf?src-supplier=Future+Electronics; ComponentLink7Description: https://datasheet.octopart.com:443/RC0805FR-078K87L-Yageo-datasheet-8324252.pdf?src-supplier=Future+Electronics; ComponentLink8URL: https://datasheet.octopart.com/RC0805FR-078K87L-Yageo-datasheet-73766026.pdf; ComponentLink8Description: https://datasheet.octopart.com/RC0805FR-078K87L-Yageo-datasheet-73766026.pdf; ComponentLink9URL: https://datasheet.octopart.com:443/RC0805FR-078K87L-Yageo-datasheet-118657.pdf?src-supplier=DigiKey; ComponentLink9Description: https://datasheet.octopart.com:443/RC0805FR-078K87L-Yageo-datasheet-118657.pdf?src-supplier=DigiKey; ComponentLink10URL: http://sigma.octopart.com:80/conflict_mineral_statement/Yageo-company-3.pdf?src-supplier=Compliance+Statements; ComponentLink10Description: http://sigma.octopart.com:80/conflict_mineral_statement/Yageo-company-3.pdf?src-supplier=Compliance+Statements; ComponentLink11URL: http://sigma.octopart.com:80/rohs_statement/Yageo-company-2.pdf?src-supplier=Compliance+Statements; ComponentLink11Description: http://sigma.octopart.com:80/rohs_statement/Yageo-company-2.pdf?src-supplier=Compliance+Statements
R32 = RC0805FR-0713K3L: Res Thick Film 0805 13.3K Ohm 1% 0.125W(1/8W) ±100ppm/C Pad SMD T/R; Manufacturer: Yageo Group; Max Power Dissipation: 125mW; Temperature Coefficient: 100ppm/°C; Voltage Rating: 150V; Supplier: Farnell; Supplier Part Number: RC0805FR-0713K3L; Manufacturer Part Number: RC0805FR-0713K3L; RoHS: Compliant; Category: Chip SMD Resistors; Stock: 7949; Pricing: 10=0,0076, 100=0,0069, 500=0,0068, 1000=0,0066, 2500=0,0065 (EUR); Case/Package: 0805; Case Code (Imperial): 0805; China RoHS: Non-Compliant; Composition: Thick Film; Contact Plating: Lead, Tin; Country of Origin: Mainland China, Taiwan; Depth: 1.25mm; Export Control Classification Number (ECCN) Code: EAR99; Features: Moisture Resistant; Height: 500µm; Harmonized Tariff Schedule (HTS) Code: 8533.21.00.30; Introduction Date: 2004-09-22; Lead Free: Lead Free; Length: 2mm; Lifecycle Status: Production; Max Operating Temperature: 155°C; Military Standard: Not; Min Operating Temperature: -55°C; Mounting Technology: Surface Mount; Number of Terminals: 2; Number of Terminations: 2; Packaging: Tape & Reel; Power Rating: 125mW; Radiation Hardening: No; REACH SVHC: Yes; Schedule B: 8533210045, 8533210045|8533210045|8533210045|8533210045|8533210045; Termination: SMD/SMT; Tolerance: 1%; Width: 1.25mm; Working Voltage: 150V; ComponentLink1URL: https://datasheet.octopart.com:443/RC0805FR-0713K3L-Yageo-datasheet-175887523.pdf?src-supplier=Newark; ComponentLink1Description: https://datasheet.octopart.com:443/RC0805FR-0713K3L-Yageo-datasheet-175887523.pdf?src-supplier=Newark; ComponentLink2URL: https://datasheet.octopart.com:443/RC0805FR-0713K3L-Yageo-datasheet-103092701.pdf?src-supplier=Upverter; ComponentLink2Description: https://datasheet.octopart.com:443/RC0805FR-0713K3L-Yageo-datasheet-103092701.pdf?src-supplier=Upverter; ComponentLink3URL: https://datasheet.octopart.com:443/RC0805FR-0713K3L-Yageo-Group-datasheet-176638170.pdf?src-supplier=Future+Electronics; ComponentLink3Description: https://datasheet.octopart.com:443/RC0805FR-0713K3L-Yageo-Group-datasheet-176638170.pdf?src-supplier=Future+Electronics; ComponentLink4URL: https://datasheet.octopart.com:443/RC0805FR-0713K3L-Yageo-datasheet-164759695.pdf?src-supplier=Future+Electronics; ComponentLink4Description: https://datasheet.octopart.com:443/RC0805FR-0713K3L-Yageo-datasheet-164759695.pdf?src-supplier=Future+Electronics; ComponentLink5URL: https://datasheet.octopart.com:443/RC0805FR-0713K3L-Yageo-datasheet-12592811.pdf?src-supplier=Future+Electronics; ComponentLink5Description: https://datasheet.octopart.com:443/RC0805FR-0713K3L-Yageo-datasheet-12592811.pdf?src-supplier=Future+Electronics; ComponentLink6URL: https://datasheet.octopart.com:443/RC0805FR-0713K3L-Yageo-datasheet-8330313.pdf?src-supplier=Future+Electronics; ComponentLink6Description: https://datasheet.octopart.com:443/RC0805FR-0713K3L-Yageo-datasheet-8330313.pdf?src-supplier=Future+Electronics; ComponentLink7URL: https://datasheet.octopart.com:443/RC0805FR-0713K3L-Yageo-datasheet-8324252.pdf?src-supplier=Future+Electronics; ComponentLink7Description: https://datasheet.octopart.com:443/RC0805FR-0713K3L-Yageo-datasheet-8324252.pdf?src-supplier=Future+Electronics; ComponentLink8URL: https://datasheet.octopart.com:443/RC0805FR-0713K3L-Yageo-datasheet-148775077.pdf?src-supplier=TME; ComponentLink8Description: https://datasheet.octopart.com:443/RC0805FR-0713K3L-Yageo-datasheet-148775077.pdf?src-supplier=TME; ComponentLink9URL: https://datasheet.octopart.com/RC0805FR-0713K3L-Yageo-datasheet-73766026.pdf; ComponentLink9Description: https://datasheet.octopart.com/RC0805FR-0713K3L-Yageo-datasheet-73766026.pdf; ComponentLink10URL: https://datasheet.octopart.com:443/RC0805FR-0713K3L-Yageo-datasheet-118657.pdf?src-supplier=DigiKey; ComponentLink10Description: https://datasheet.octopart.com:443/RC0805FR-0713K3L-Yageo-datasheet-118657.pdf?src-supplier=DigiKey; ComponentLink11URL: http://sigma.octopart.com:80/conflict_mineral_statement/Yageo-company-3.pdf?src-supplier=Compliance+Statements; ComponentLink11Description: http://sigma.octopart.com:80/conflict_mineral_statement/Yageo-company-3.pdf?src-supplier=Compliance+Statements; ComponentLink12URL: http://sigma.octopart.com:80/rohs_statement/Yageo-company-2.pdf?src-supplier=Compliance+Statements; ComponentLink12Description: http://sigma.octopart.com:80/rohs_statement/Yageo-company-2.pdf?src-supplier=Compliance+Statements
R35 = RC0603FR-0771K5L: Res Thick Film 0603 71.5K Ohm 1% 0.1W(1/10W) ±100ppm/C Pad SMD T/R; Manufacturer: Yageo Group; Max Power Dissipation: 100mW; Temperature Coefficient: 100ppm/°C; Voltage Rating: 75V; Voltage Rating (DC): 50V; Supplier: Farnell; Supplier Part Number: RC0603FR-0771K5L; Manufacturer Part Number: RC0603FR-0771K5L; RoHS: Compliant; Category: Chip SMD Resistors; Stock: 10380; Pricing: 10=0,0061, 100=0,0052, 500=0,0048, 1000=0,0043, 2500=0,0037 (EUR); Case/Package: 0603; Case Code (Imperial): 0603; China RoHS: Non-Compliant; Composition: Thick Film; Country of Origin: Mainland China, Taiwan; Export Control Classification Number (ECCN) Code: EAR99; Features: Moisture Resistant; Height: 450µm; Harmonized Tariff Schedule (HTS) Code: 8533.21.00.30; Introduction Date: 2004-09-22; Lead Free: Lead Free; Length: 1.6mm; Lifecycle Status: Production; Max Operating Temperature: 155°C; Min Operating Temperature: -55°C; Mounting Technology: Surface Mount; Number of Terminals: 2; Number of Terminations: 2; Packaging: Tape & Reel; Power Rating: 100mW; REACH SVHC: Yes; Schedule B: 8533210045, 8533210045|8533210045, 8533210045|8533210045|8533210045, 8533210045|8533210045|8533210045|8533210045; Termination: SMD/SMT; Tolerance: 1%; Weight: 2.012816mg; Width: 800µm; Working Voltage: 75V; ComponentLink1URL: https://datasheet.octopart.com:443/RC0603FR-0771K5L-Yageo-datasheet-175887523.pdf?src-supplier=Newark; ComponentLink1Description: https://datasheet.octopart.com:443/RC0603FR-0771K5L-Yageo-datasheet-175887523.pdf?src-supplier=Newark; ComponentLink2URL: https://datasheet.octopart.com:443/RC0603FR-0771K5L-Yageo-datasheet-103092701.pdf?src-supplier=Upverter; ComponentLink2Description: https://datasheet.octopart.com:443/RC0603FR-0771K5L-Yageo-datasheet-103092701.pdf?src-supplier=Upverter; ComponentLink3URL: https://datasheet.octopart.com:443/RC0603FR-0771K5L-Yageo-Group-datasheet-190305687.pdf?src-supplier=Future+Electronics; ComponentLink3Description: https://datasheet.octopart.com:443/RC0603FR-0771K5L-Yageo-Group-datasheet-190305687.pdf?src-supplier=Future+Electronics; ComponentLink4URL: https://datasheet.octopart.com:443/RC0603FR-0771K5L-Yageo-datasheet-164759695.pdf?src-supplier=Future+Electronics; ComponentLink4Description: https://datasheet.octopart.com:443/RC0603FR-0771K5L-Yageo-datasheet-164759695.pdf?src-supplier=Future+Electronics; ComponentLink5URL: https://datasheet.octopart.com:443/RC0603FR-0771K5L-Yageo-datasheet-137700087.pdf?src-supplier=Future+Electronics; ComponentLink5Description: https://datasheet.octopart.com:443/RC0603FR-0771K5L-Yageo-datasheet-137700087.pdf?src-supplier=Future+Electronics; ComponentLink6URL: https://datasheet.octopart.com:443/RC0603FR-0771K5L-Yageo-datasheet-17842380.pdf?src-supplier=Future+Electronics; ComponentLink6Description: https://datasheet.octopart.com:443/RC0603FR-0771K5L-Yageo-datasheet-17842380.pdf?src-supplier=Future+Electronics; ComponentLink7URL: https://datasheet.octopart.com:443/RC0603FR-0771K5L-Yageo-datasheet-15599030.pdf?src-supplier=Future+Electronics; ComponentLink7Description: https://datasheet.octopart.com:443/RC0603FR-0771K5L-Yageo-datasheet-15599030.pdf?src-supplier=Future+Electronics; ComponentLink8URL: https://datasheet.octopart.com:443/RC0603FR-0771K5L-Yageo-datasheet-12596169.pdf?src-supplier=Future+Electronics; ComponentLink8Description: https://datasheet.octopart.com:443/RC0603FR-0771K5L-Yageo-datasheet-12596169.pdf?src-supplier=Future+Electronics; ComponentLink9URL: https://datasheet.octopart.com:443/RC0603FR-0771K5L-Yageo-datasheet-8328172.pdf?src-supplier=Future+Electronics; ComponentLink9Description: https://datasheet.octopart.com:443/RC0603FR-0771K5L-Yageo-datasheet-8328172.pdf?src-supplier=Future+Electronics; ComponentLink10URL: https://datasheet.octopart.com:443/RC0603FR-0771K5L-Yageo-Group-datasheet-189192902.pdf?src-supplier=TME; ComponentLink10Description: https://datasheet.octopart.com:443/RC0603FR-0771K5L-Yageo-Group-datasheet-189192902.pdf?src-supplier=TME; ComponentLink11URL: https://datasheet.octopart.com:443/RC0603FR-0771K5L-Yageo-Group-datasheet-176638170.pdf?src-supplier=TME; ComponentLink11Description: https://datasheet.octopart.com:443/RC0603FR-0771K5L-Yageo-Group-datasheet-176638170.pdf?src-supplier=TME; ComponentLink12URL: https://datasheet.octopart.com:443/RC0603FR-0771K5L-Yageo-datasheet-79472498.pdf?src-supplier=Megastar; ComponentLink12Description: https://datasheet.octopart.com:443/RC0603FR-0771K5L-Yageo-datasheet-79472498.pdf?src-supplier=Megastar; ComponentLink13URL: https://datasheet.octopart.com/RC0603FR-0771K5L-Yageo-datasheet-73766026.pdf; ComponentLink13Description: https://datasheet.octopart.com/RC0603FR-0771K5L-Yageo-datasheet-73766026.pdf; ComponentLink14URL: https://datasheet.octopart.com:443/RC0603FR-0771K5L-Yageo-datasheet-118562.pdf?src-supplier=DigiKey; ComponentLink14Description: https://datasheet.octopart.com:443/RC0603FR-0771K5L-Yageo-datasheet-118562.pdf?src-supplier=DigiKey; ComponentLink15URL: http://sigma.octopart.com:80/conflict_mineral_statement/Yageo-company-3.pdf?src-supplier=Compliance+Statements; ComponentLink15Description: http://sigma.octopart.com:80/conflict_mineral_statement/Yageo-company-3.pdf?src-supplier=Compliance+Statements; ComponentLink16URL: http://sigma.octopart.com:80/rohs_statement/Yageo-company-2.pdf?src-supplier=Compliance+Statements; ComponentLink16Description: http://sigma.octopart.com:80/rohs_statement/Yageo-company-2.pdf?src-supplier=Compliance+Statements